# Altium schematic sheet IO.SchDoc
size A; Organization: Altium Limited; Address1: L3, 12a Rodborough Rd; Address2: Frenchs Forest; Address3: NSW; Address4: Australia 2086
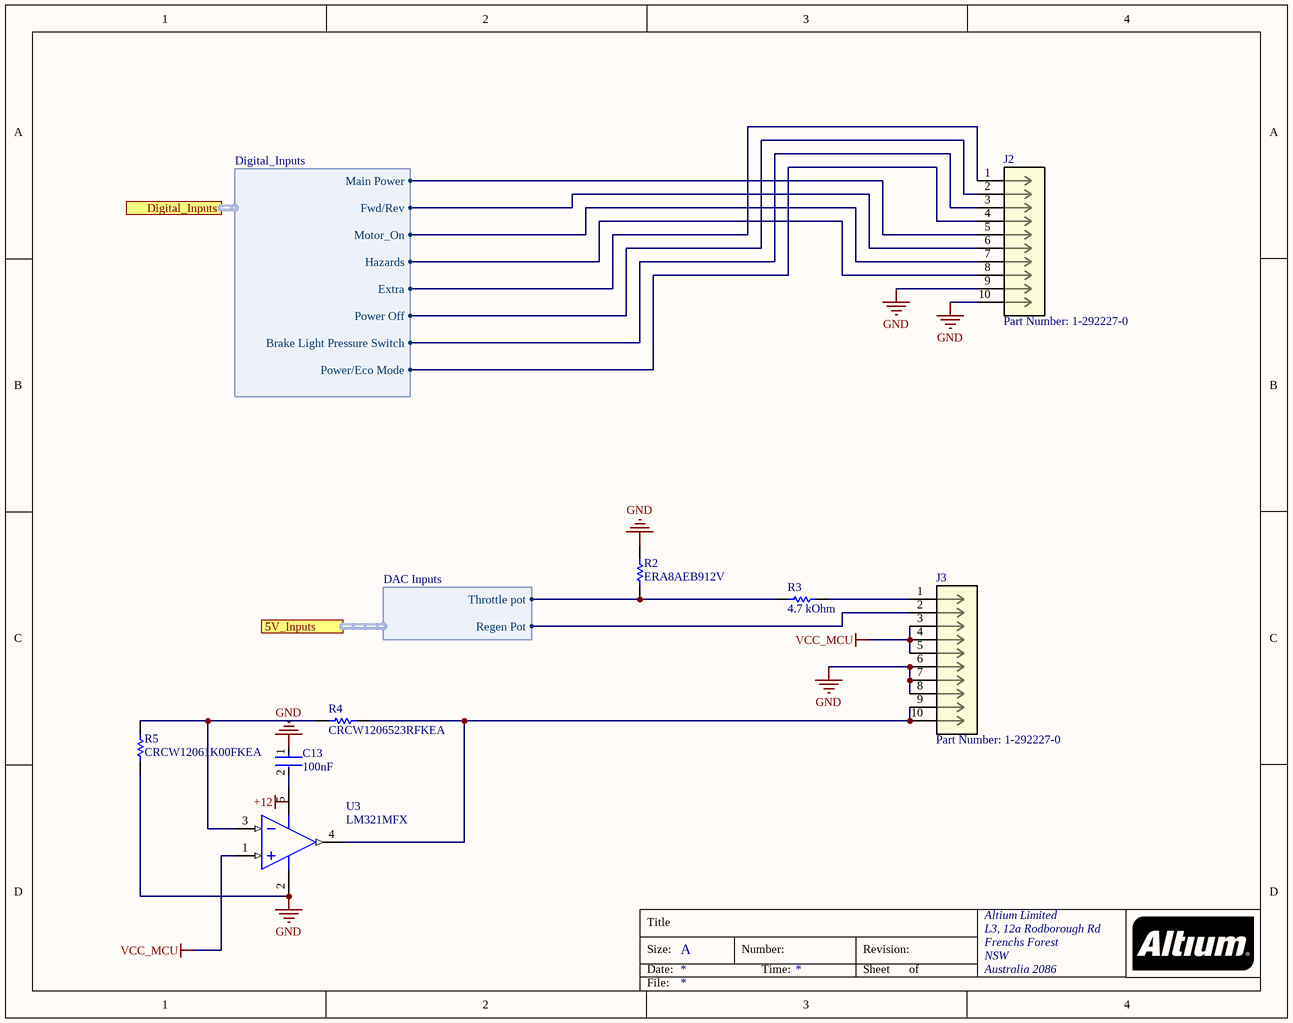
[diagram p0: IO.SchDoc]

## Parts
C13  100nF  [Kemet_C0603_IPC_A]
J2  Part Number: 1-292227-0  [CON10_1X10_DRH_H]
J3  Part Number: 1-292227-0  [CON10_1X10_DRH_H]
R2  ERA8AEB912V  [RESC3216X70X50ML20T25]
R3  4.7 kOhm  [RESC3216X60X45ML15T20]
R4  CRCW1206523RFKEA  [RESC3216X60X45NL10T20]
R5  CRCW12061K00FKEA  [RESC3216X60X45ML15T20]
U3  LM321MFX  [DBV0005A_L]

## Ports
5V_Inputs (harness DAC Inputs), Digital_Inputs (harness Digital_Inputs)

## Harnesses
Digital_Inputs: Main Power, Fwd/Rev, Motor_On, Hazards, Power/Eco Mode, Brake Light Pressure Switch, Power Off, Extra
DAC Inputs: Throttle pot, Regen Pot

## Nets
GND: C13.1 J2.9 J2.10 J3.6 J3.7 J3.8 R2.1 R5.2 U3.2(V-)
VCC_MCU: J3.3 J3.4 J3.5 U3.1(IN+)
NetC13_2: C13.2 U3.5(V+)
NetJ2_1: J2.1 ; port Digital_Inputs.Extra
NetJ2_2: J2.2 ; port Digital_Inputs.Power Off
NetJ2_3: J2.3 ; port Digital_Inputs.Brake Light Pressure Switch
NetJ2_4: J2.4 ; port Digital_Inputs.Power/Eco Mode
NetJ2_5: J2.5 ; port Digital_Inputs.Main Power
NetJ2_6: J2.6 ; port Digital_Inputs.Fwd/Rev
NetJ2_7: J2.7 ; port Digital_Inputs.Motor_On
NetJ2_8: J2.8 ; port Digital_Inputs.Hazards
NetJ3_1: J3.1 R3.1
NetJ3_2: J3.2 ; port 5V_Inputs.Regen Pot
NetJ3_9: J3.9 J3.10 R4.1 U3.4(OUT)
NetR2_2: R2.2 R3.2 ; port 5V_Inputs.Throttle pot
NetR4_2: R4.2 R5.1 U3.3(IN-)

## Notes on the sheet
- Labels drawn without touching a wire or pin: +12
- Title
- Size:
- Date:
- A
- Number:
- Time:
- Revision:
- Sheet
- of
- File:

## Library data of the parts
C13 = C0603C104K5RACTU: CAP CER 0.1UF 100NF 50V X7R 0603 C0603C104K5RACTU
J2 J3 = 1-292227-0: No Description Available; Vendor: TE Connectivity; Built_By: EMA_UL_Team; Manufacturer_Part_Number: 1-292227-0; Copyright: Copyright (C) 2018 Accelerated Designs. All rights reserved; RefDes: RefDes; Type: DEV; Value: Value
R2 = CMP-2003-00013-1: Manufacturer: Panasonic; Part Number: ERA8AEB912V
R3 = CMP-2100-03618-1: Chip Resistor, 4.7 KOhm, +/- 1%, 0.25 W, -55 to 155 degC, 1206 (3216 Metric), RoHS, Tape and Reel; Manufacturer: Vishay Semiconductor; Power Rating: 250mW; Voltage Rating: 200V; Temperature Coefficient: 100ppm/degreesC; Package Quantity: 10; Composition: ThickFilm; REACH SVHC: Unknown; Mount: SurfaceMount; Max Operating Temperature: 155degC; Length: 3.2mm; Number of Terminations: 2; Case Code (Metric): 3216; Military Standard: Not; Width: 1.6mm; Datasheet Version: 41061.0; Max Power Dissipation: 250mW; Datasheet URL: http://www.vishay.com/docs/20035/dcrcwe3.pdf; Contact Plating: Tin; Case/Package: 1206; Height: 0.55mm; Package Reference: 1206.0; Lead Free: LeadFree; Weight: 0.000353oz; Package Description: 2-Pin Surface Mount Device, Body 3.15 x 1.6 mm; Min Operating Temperature: -55degC; Resistance: 4.7KOhm; Packaging: TapeandReel; Depth: 1.6mm; Tolerance: 1%; RoHSCompliant: true; Termination: SMD/SMT; Case Code (Imperial): 1206; Voltage Rating (DC): 200V; Radiation Hardening: No; Manufacturer URL: http://www.vishay.com/
R4 = CMP-2003-02266-1: Manufacturer: Vishay Dale; Part Number: CRCW1206523RFKEA
R5 = CMP-2100-03616-1: Chip Resistor, 1 KOhm, +/- 1%, 0.25 W, -55 to 155 degC, 1206 (3216 Metric), RoHS, Tape and Reel; Manufacturer: Vishay Semiconductor; Power Rating: 250mW; Voltage Rating (DC): 200V; Resistance: 1KOhm; Temperature Coefficient: 100ppm/degreesC; Case Code (Imperial): 1206; Length: 3.2mm; Case/Package: 1206; Contact Plating: Tin; Package Quantity: 10; Datasheet URL: http://www.farnell.com/datasheets/1720486.pdf; Mount: SurfaceMount; Package Description: 2-Pin Surface Mount Device, Body 3.15 x 1.6 mm; Package Reference: 1206.0; Max Operating Temperature: 155degC; Lead Free: LeadFree; Weight: 0.000353oz; Military Standard: Not; Max Power Dissipation: 250mW; Case Code (Metric): 3216; Number of Terminations: 2; Tolerance: 1%; Width: 0.063inch; Termination: SMD/SMT; Number of Pins: 2; Min Operating Temperature: -55degC; Height: 0.55mm; Depth: 1.6mm; RoHSCompliant: true; Composition: ThickFilm; Packaging: TapeandReel; Manufacturer URL: http://www.vishay.com/; Voltage Rating: 200V; Radiation Hardening: No; REACH SVHC: Unknown; Datasheet Version: 41061.0
U3 = CMP-0055-01337-3: Low Power Single Op Amp, 5-pin SOT-23; Manufacturer: Texas Instruments; PowerWise: N; CompType: Amplifiers; PackageTopMarking: A63A*XTT; ComponentLink1Description: Datasheet URL; PackageDescription: Molded SOT-23, .115 x .063 x .040 in Body, 5 Lead, .0375 in Pitch; PinCount: 5; ComponentLink1URL: http://www.ti.com/general/docs/lit/getliterature.tsp?genericPartNumber=LM321&fileType=pdf; RoHS: N; Package Reference: DBV0005A